# Altium project Arduino Uno.PrjPcb (part 2 of 3)
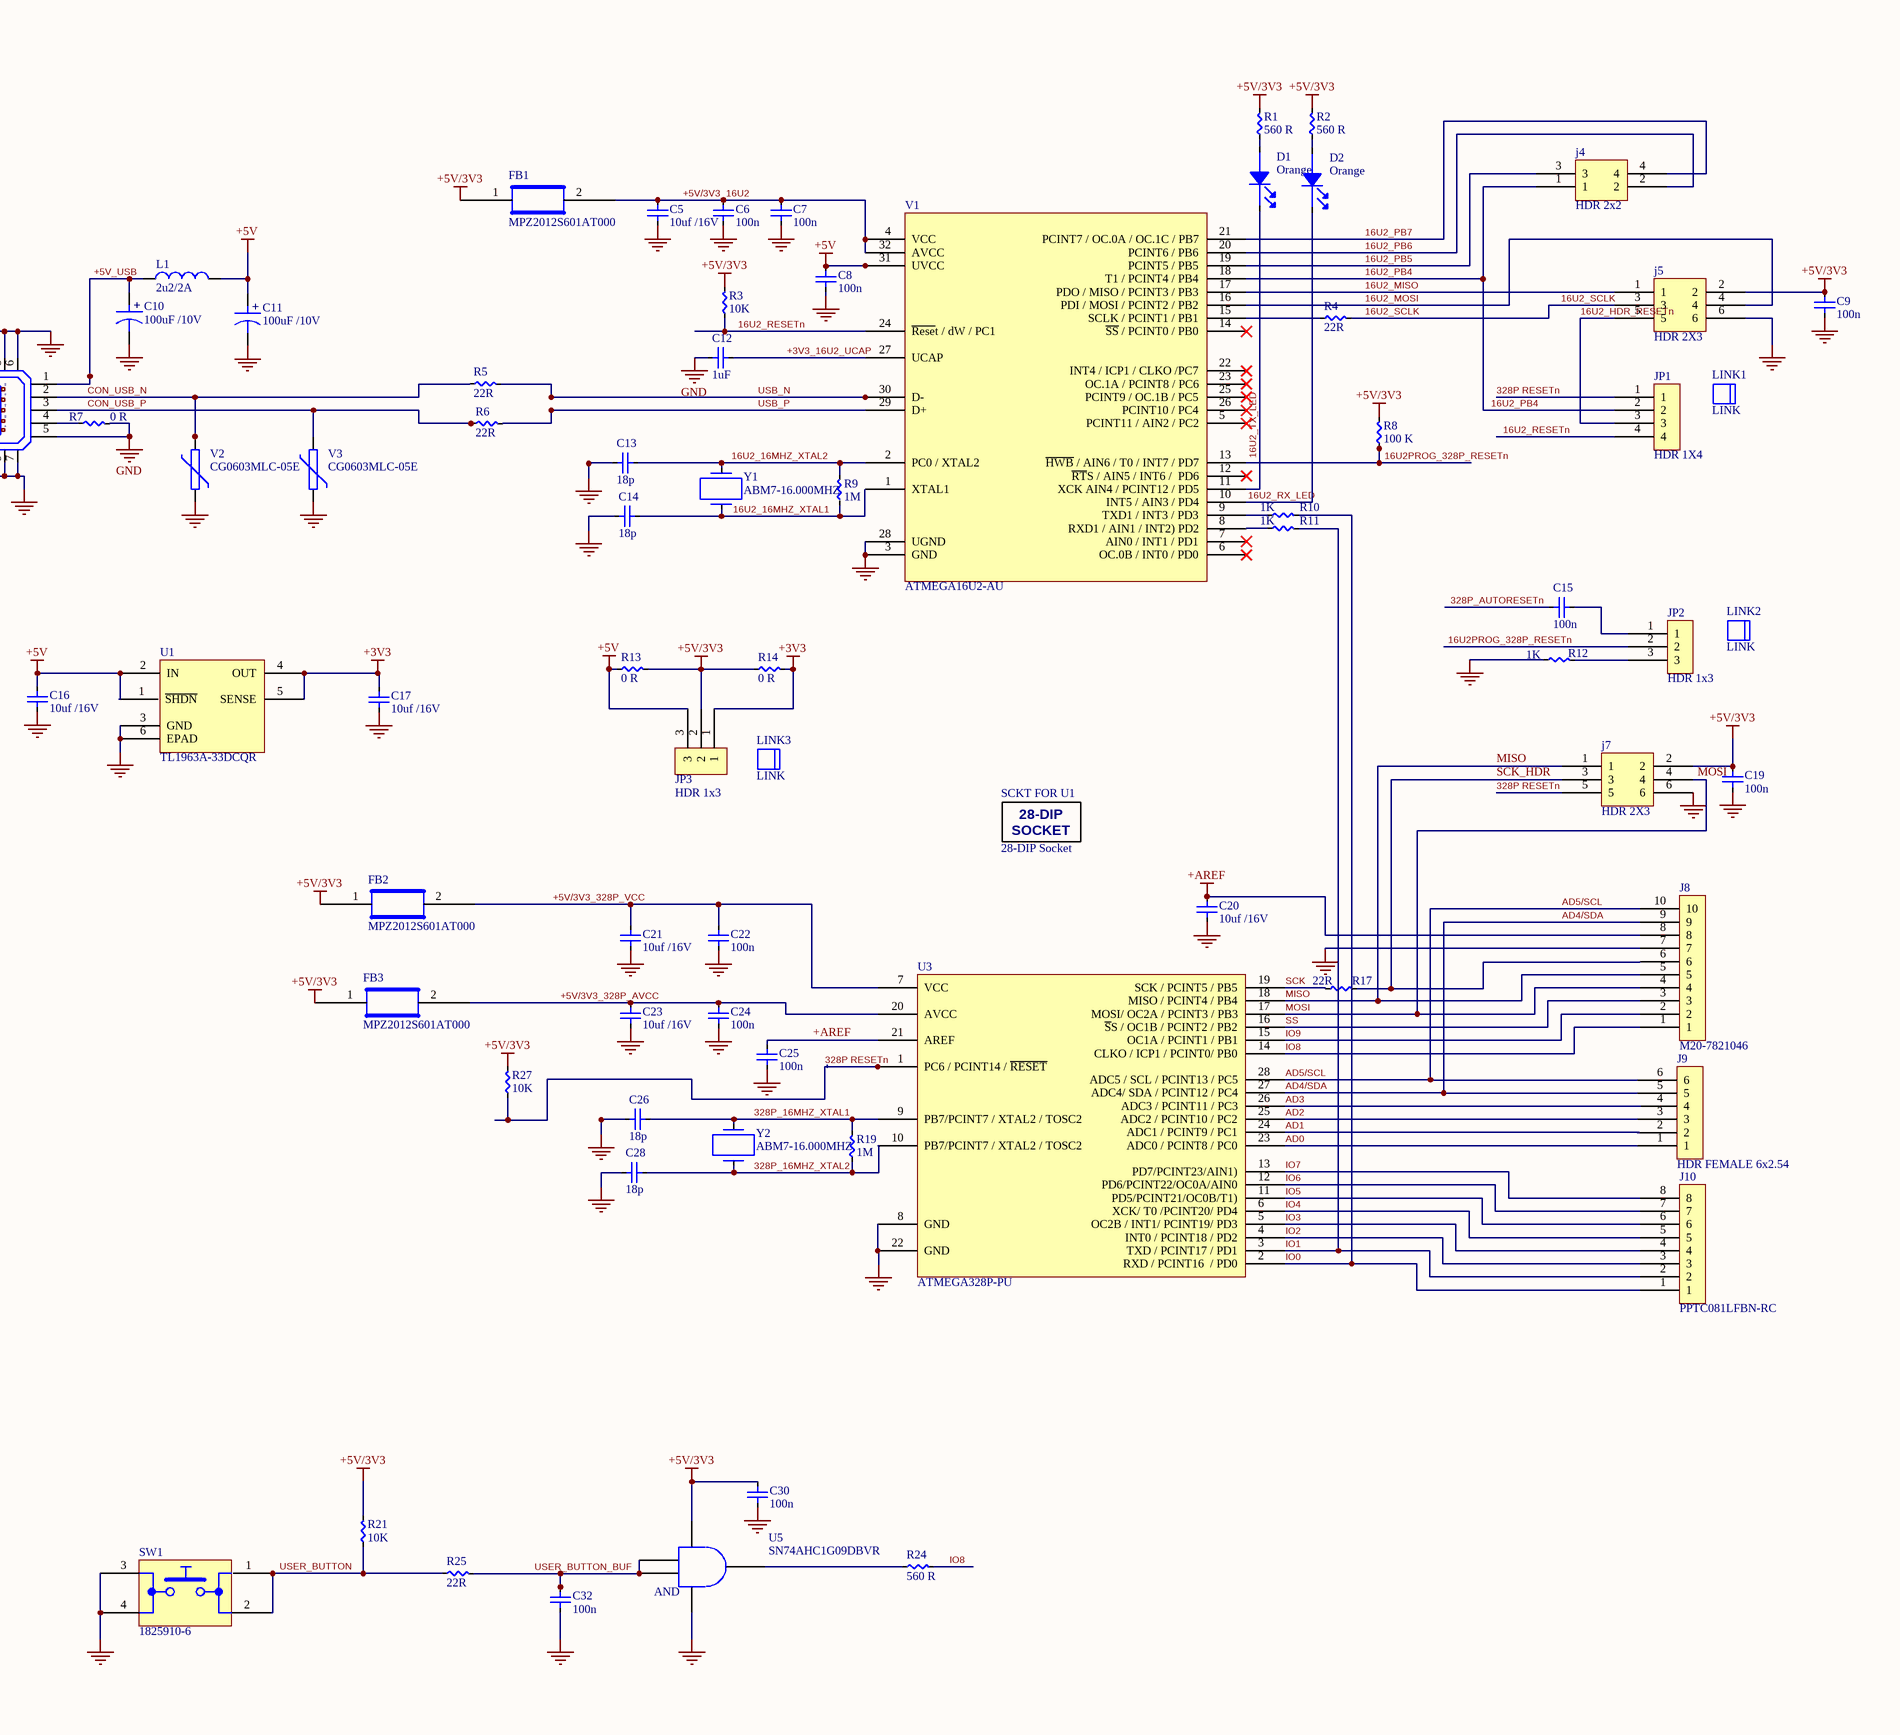
[diagram p2: Arduino_UNO_schematic.SchDoc, right]

## Sheet Arduino_UNO_schematic.SchDoc (continued)
### Library data of the parts
C1-C3 C6-C9 C15 C18 C19 C22 C24 C25 C27 C29-C33 = C0805C104M5RACAUTO: Cap Ceramic 0.1uF 50V X7R 20% SMD 0805 125°C Punched Paper T/R; Manufacturer: KEMET; Capacitance: 100nF; Mount: Surface Mount; Case/Package: 0805; Case Code (Metric): 2012; Case Code (Imperial): 0805; Contact Plating: Tin,Matte; Dielectric Material: Ceramic; Min Operating Temperature: -55°C; Max Operating Temperature: 125°C; Tolerance: 20%; Packaging: Cut Tape; Dielectric: X7R; Voltage Rating: 50V; Voltage Rating (DC): 50V; Termination: Wraparound; Length: 2mm; Width: 0.049inch; Thickness: 0.035inch; Depth: 1.25mm; Ratings: AEC-Q200; REACH SVHC: No SVHC; ComponentLink1URL: http://components.arrow.com/part/dataview/0323_00324909?src-supplier=Arrow+Europe; ComponentLink1Description: http://components.arrow.com/part/dataview/0323_00324909?src-supplier=Arrow+Europe; ComponentLink2URL: http://www.farnell.com/datasheets/2741360.pdf?src-supplier=Farnell; ComponentLink2Description: http://www.farnell.com/datasheets/2741360.pdf?src-supplier=Farnell; ComponentLink3URL: http://components.arrow.com/part/dataview/42933023S8615449N7429?src-supplier=Arrow; ComponentLink3Description: http://components.arrow.com/part/dataview/42933023S8615449N7429?src-supplier=Arrow; ComponentLink4URL: http://capacitoredge.kemet.com/capedge2/DataSheet/Datasheet-C0805C104M5RACAUTO.pdf?pn=C0805C104M5RACAUTO&src-supplier=Avnet+Asia; ComponentLink4Description: http://capacitoredge.kemet.com/capedge2/DataSheet/Datasheet-C0805C104M5RACAUTO.pdf?pn=C0805C104M5RACAUTO&src-supplier=Avnet+Asia; ComponentLink5URL: http://www.farnell.com/datasheets/2741360.pdf?src-supplier=Newark; ComponentLink5Description: http://www.farnell.com/datasheets/2741360.pdf?src-supplier=Newark; ComponentLink6URL: https://api.kemet.com/component-edge/download/datasheet/C0805C104M5RACAUTO.pdf?src-supplier=Digi-Key; ComponentLink6Description: https://api.kemet.com/component-edge/download/datasheet/C0805C104M5RACAUTO.pdf?src-supplier=Digi-Key; ComponentLink7URL: http://www.farnell.com/datasheets/2741360.pdf?src-supplier=Element14; ComponentLink7Description: http://www.farnell.com/datasheets/2741360.pdf?src-supplier=Element14; Manufacturer Part Number: C0805C104M5RACAUTO; Pricing 1: 1 = 0.15000, 10 = 0.11000, 50 = 0.06240, 100 = 0.05170, 500 = 0.03628, 1000 = 0.03004 (USD); RoHS: Yes; Stock 1: 12974; Supplier 1: Digi-Key; Supplier Part Number 1: 399-12977-6-ND
C4 C5 C16 C17 C20 C21 C23 = CGA4J1X7S1C106K125AC: TDK - CGA4J1X7S1C106K125AC - CGA4J1X7S1C106KT000N; Tolerance: 10%; Voltage Rating: 16V; Dielectric: X7S; Mount: Surface Mount; Case/Package: 0805; Weight: 0.000194oz; Case Code (Metric): 2012; Case Code (Imperial): 0805; Min Operating Temperature: -55°C; Max Operating Temperature: 125°C; Package Quantity: 2000; Packaging: Tape and Reel; Capacitance: 10uF; Termination: SMD/SMT; Voltage Rating (DC): 16V; Length: 0.079inch; Height: 1.25mm; Thickness: 0.057inch; Width: 0.049inch; Ratings: AEC-Q200; Lead Free: Lead Free; ComponentLink1URL: http://www.farnell.com/datasheets/2370668.pdf?src-supplier=Farnell; ComponentLink1Description: http://www.farnell.com/datasheets/2370668.pdf?src-supplier=Farnell; ComponentLink2URL: https://product.tdk.com/info/en/catalog/spec/mlccspec_automotive_general_midvoltage_en.pdf?src-supplier=Digi-Key; ComponentLink2Description: https://product.tdk.com/info/en/catalog/spec/mlccspec_automotive_general_midvoltage_en.pdf?src-supplier=Digi-Key; ComponentLink3URL: http://www.farnell.com/datasheets/2370668.pdf?src-supplier=Element14; ComponentLink3Description: http://www.farnell.com/datasheets/2370668.pdf?src-supplier=Element14; ComponentLink4URL: http://product.tdk.com/en/catalog/datasheets/mlcc_automotive_general_en.pdf?src-supplier=Avnet; ComponentLink4Description: http://product.tdk.com/en/catalog/datasheets/mlcc_automotive_general_en.pdf?src-supplier=Avnet; ComponentLink5URL: http://www.farnell.com/datasheets/2370668.pdf?src-supplier=Newark; ComponentLink5Description: http://www.farnell.com/datasheets/2370668.pdf?src-supplier=Newark; ComponentLink6URL: http://product.tdk.com/capacitor/mlcc/detailed_information.php?lang=en&ref=jp&part_no=CGA4J1X7S1C106K125AC&src-supplier=Mouser; ComponentLink6Description: http://product.tdk.com/capacitor/mlcc/detailed_information.php?lang=en&ref=jp&part_no=CGA4J1X7S1C106K125AC&src-supplier=Mouser; Manufacturer Part Number: CGA4J1X7S1C106K125AC; Manufacturer: TDK; Pricing 1: 1 = 0.43000, 10 = 0.30100, 50 = 0.22780, 100 = 0.19850, 500 = 0.14700, 1000 = 0.12495 (USD); RoHS: Yes; Stock 1: 230671; Supplier 1: Digi-Key; Supplier Part Number 1: 445-16110-1-ND
C10 C11 = EEE-1AA101SP: GLOVE, POLYAMIDE, L/FREE, PU, SIZE 6 - More Details; Manufacturer: Panasonic; Tolerance: 20%; Ripple Current: 70mA; Voltage Rating: 10V; Polarity: Polar; Life (Hours): 2000Hour; Leakage Current: 3uA; Mount: Surface Mount,PCB; Case/Package: Radial; Contact Plating: Tin; Min Operating Temperature: -40°C; Max Operating Temperature: 85°C; Capacitance: 100uF; Packaging: Tape and Reel; Package Quantity: 1000; Voltage Rating (DC): 10V; Termination: SMD/SMT; Ripple Current (AC): 70mA; Features: General Purpose; Voltage: 10V; Diameter: 6.3mm; Length: 5.5mm; Height: 5.4mm; Height - Seated (Max): 0.213inch; Radiation Hardening: No; Lead Free: Lead Free; REACH SVHC: Unknown; ComponentLink1URL: https://datasheet.ciiva.com/14604/70255710-14604862.pdf?src-supplier=Allied+Electronics; ComponentLink1Description: https://datasheet.ciiva.com/14604/70255710-14604862.pdf?src-supplier=Allied+Electronics; ComponentLink2URL: https://datasheet.ciiva.com/2983/aba0000ce2-2983905.pdf?src-supplier=Avnet; ComponentLink2Description: https://datasheet.ciiva.com/2983/aba0000ce2-2983905.pdf?src-supplier=Avnet; ComponentLink3URL: https://datasheet.ciiva.com/31414/aba0000ce2-31414629.pdf?src-supplier=Farnell; ComponentLink3Description: https://datasheet.ciiva.com/31414/aba0000ce2-31414629.pdf?src-supplier=Farnell; ComponentLink4URL: https://datasheet.ciiva.com/17536/aba0000ce2-17536070.pdf?src-supplier=Avnet+Europe; ComponentLink4Description: https://datasheet.ciiva.com/17536/aba0000ce2-17536070.pdf?src-supplier=Avnet+Europe; ComponentLink5URL: https://datasheet.ciiva.com/30099/11aba0000ce2-30099766.pdf?src-supplier=Onlinecomponents.com; ComponentLink5Description: https://datasheet.ciiva.com/30099/11aba0000ce2-30099766.pdf?src-supplier=Onlinecomponents.com; ComponentLink6URL: https://datasheet.ciiva.com/43470/aba0000ce2-43470621.pdf?src-supplier=Farnell; ComponentLink6Description: https://datasheet.ciiva.com/43470/aba0000ce2-43470621.pdf?src-supplier=Farnell; ComponentLink7URL: https://datasheet.ciiva.com/2985/aba0000ce2-2985040.pdf?src-supplier=Avnet; ComponentLink7Description: https://datasheet.ciiva.com/2985/aba0000ce2-2985040.pdf?src-supplier=Avnet; ComponentLink8URL: https://datasheet.ciiva.com/15166/getdatasheetpartid-178534-15166250.pdf?src-supplier=Verical; ComponentLink8Description: https://datasheet.ciiva.com/15166/getdatasheetpartid-178534-15166250.pdf?src-supplier=Verical; ComponentLink9URL: https://datasheet.ciiva.com/46378/aba0000ce2-46378266.pdf?src-supplier=Element14; ComponentLink9Description: https://datasheet.ciiva.com/46378/aba0000ce2-46378266.pdf?src-supplier=Element14; ComponentLink10URL: https://datasheet.ciiva.com/14598/70255710-14598444.pdf?src-supplier=Allied+Electronics; ComponentLink10Description: https://datasheet.ciiva.com/14598/70255710-14598444.pdf?src-supplier=Allied+Electronics; ComponentLink11URL: https://datasheet.ciiva.com/46374/aba0000ce2-46374349.pdf?src-supplier=Element14; ComponentLink11Description: https://datasheet.ciiva.com/46374/aba0000ce2-46374349.pdf?src-supplier=Element14; Manufacturer Part Number: EEE-1AA101SP; RoHS: Yes; Pricing 1: 1 = 0.30000, 10 = 0.20900, 50 = 0.14640, 100 = 0.12540, 500 = 0.09406 (USD); Stock 1: 1; Supplier 1: Digi-Key; Supplier Part Number 1: PCE3866CT-ND
C12 = C2012X5R1E105K125AA: TDK - C2012X5R1E105K125AA - SMD Multilayer Ceramic Capacitor, 1 µF, 25 V, 0805 [2012 Metric], ± 10%, X5R, C Series; Voltage Rating: 25V; Mount: Surface Mount; Case/Package: 0805; Number of Pins: 2; Weight: 0.000194oz; Case Code (Metric): 2012; Case Code (Imperial): 0805; Dielectric Material: Ceramic; Min Operating Temperature: -55°C; Max Operating Temperature: 85°C; Capacitance: 1uF; Packaging: Tape and Reel; Voltage Rating (DC): 25V; Termination: SMD/SMT; Dielectric: X5R; Tolerance: 10%; Package Quantity: 2000; Resistor Type: Ceramic; Voltage: 25V; Length: 2mm; Height: 1.25mm; Depth: 1.25mm; Width: 0.049inch; Thickness: 0.057inch; Radiation Hardening: No; Lead Free: Lead Free; REACH SVHC: No SVHC; ComponentLink1URL: https://datasheet.ciiva.com/11787/0900766b80c1bb00-11787608.pdf?src-supplier=RSComponents; ComponentLink1Description: https://datasheet.ciiva.com/11787/0900766b80c1bb00-11787608.pdf?src-supplier=RSComponents; ComponentLink2URL: https://datasheet.ciiva.com/16449/e412-c-16449595.pdf?src-supplier=Future+Electronics; ComponentLink2Description: https://datasheet.ciiva.com/16449/e412-c-16449595.pdf?src-supplier=Future+Electronics; ComponentLink3URL: https://datasheet.ciiva.com/28602/1744655-28602171.pdf?src-supplier=Element14; ComponentLink3Description: https://datasheet.ciiva.com/28602/1744655-28602171.pdf?src-supplier=Element14; ComponentLink4URL: https://datasheet.ciiva.com/15192/getdatasheetpartid-726707-15192140.pdf?src-supplier=Verical; ComponentLink4Description: https://datasheet.ciiva.com/15192/getdatasheetpartid-726707-15192140.pdf?src-supplier=Verical; Manufacturer: TDK; Manufacturer Part Number: C2012X5R1E105K125AA; Pricing 1: 1 = 0.23000, 10 = 0.15800, 50 = 0.09500, 100 = 0.08030, 500 = 0.05492, 1000 = 0.04858 (USD); RoHS: Yes; Stock 1: 16168; Supplier 1: Digi-Key; Supplier Part Number 1: 445-1419-1-ND
C13 C14 C26 C28 = C0805C180J5GACTU: CAP CER 18PF 50V C0G/NP0 0805; Manufacturer: KEMET; Dielectric Material: Ceramic; Tolerance: 5%; Dielectric: C0G; Temperature Coefficient: 30ppm/°C; Mount: Surface Mount; Case/Package: 0805; Contact Plating: Tin,Matte; Min Operating Temperature: -55°C; Max Operating Temperature: 125°C; Capacitance: 18pF; Packaging: Tape and Reel; Voltage: 50V; Termination: SMD/SMT; Voltage Rating (DC): 50V; Length: 2mm; Height: 0.78mm; Depth: 1.25mm; Radiation Hardening: No; Lead Free: Lead Free; ComponentLink1URL: https://datasheet.ciiva.com/22746/1769375-22746770.pdf?src-supplier=Element14; ComponentLink1Description: https://datasheet.ciiva.com/22746/1769375-22746770.pdf?src-supplier=Element14; ComponentLink2URL: https://datasheet.ciiva.com/26923/getdatasheetpartid-759702-26923980.pdf?src-supplier=Verical; ComponentLink2Description: https://datasheet.ciiva.com/26923/getdatasheetpartid-759702-26923980.pdf?src-supplier=Verical; ComponentLink3URL: https://datasheet.ciiva.com/26847/getdatasheetpartid-385668-26847862.pdf?src-supplier=Verical; ComponentLink3Description: https://datasheet.ciiva.com/26847/getdatasheetpartid-385668-26847862.pdf?src-supplier=Verical; Manufacturer Part Number: C0805C180J5GACTU; Pricing 1: 1 = 0.12000, 10 = 0.08600, 50 = 0.04900, 100 = 0.04070, 500 = 0.02852, 1000 = 0.02361 (USD); RoHS: Yes; Stock 1: 105501; Supplier 1: Digi-Key; Supplier Part Number 1: 399-1112-1-ND
D1 D2 D4 = LOL29K-H2K1-24-Z: OSRAM - LO L29K-H2K1-24-Z - SMARTLED 0603 ORANGE; Manufacturer: Osram Opto; Lens Color: White; Forward Current: 20mA; Forward Voltage: 2.2V; Luminous Intensity: 9mcd; Viewing Angle: 160°; Test Current: 2mA; Lens Style: Flat,Diffused,Colorless,Rectangular; Dominant Wavelength: 606nm; Luminous Flux: 0.025lm; Number of Elements: 1; Reverse Voltage: 12V; Lens Transparency: Diffused; Lens Size: 0.8mm; Mount: Surface Mount; Case/Package: 0603; Number of Pins: 2; Color: Orange; Case Code (Metric): 1608; Case Code (Imperial): 0603; Min Operating Temperature: -40°C; Max Operating Temperature: 100°C; Packaging: Tape and Reel; Number of LEDs: 1; Illumination Color: Orange; Package Quantity: 5000; Length: 1.3mm; Height: 0.65mm; Depth: 0.8mm; Width: 0.8mm; Radiation Hardening: No; ComponentLink1URL: https://datasheet.ciiva.com/2112/00077105-0-2112904.pdf?src-supplier=Digi-Key; ComponentLink1Description: https://datasheet.ciiva.com/2112/00077105-0-2112904.pdf?src-supplier=Digi-Key; ComponentLink2URL: https://datasheet.ciiva.com/2112/00077105-0-2112905.pdf?src-supplier=Digi-Key; ComponentLink2Description: https://datasheet.ciiva.com/2112/00077105-0-2112905.pdf?src-supplier=Digi-Key; ComponentLink3URL: https://datasheet.ciiva.com/2112/00077105-0-2112906.pdf?src-supplier=Digi-Key; ComponentLink3Description: https://datasheet.ciiva.com/2112/00077105-0-2112906.pdf?src-supplier=Digi-Key; ComponentLink4URL: https://datasheet.ciiva.com/15198/getdatasheetpartid-693885-15198412.pdf?src-supplier=Verical; ComponentLink4Description: https://datasheet.ciiva.com/15198/getdatasheetpartid-693885-15198412.pdf?src-supplier=Verical; Manufacturer Part Number: LOL29K-H2K1-24-Z; Pricing 1: 1 = 0.480000, 10 = 0.342000, 100 = 0.199600, 500 = 0.136900, 1000 = 0.114080, 2500 = 0.102670 (USD); RoHS: Yes; Stock 1: 8772; Supplier 1: Digi-Key; Supplier Part Number 1: 475-2740-1-ND
D3 = LGL29K-G2J1-24-Z: LED Uni-Color Green 572nm 2-Pin Chip 0603(1608Metric) T/R; Manufacturer: Osram Opto; Lens Color: White; Forward Current: 20mA; Forward Voltage: 2.2V; Luminous Intensity: 5.6mcd; Viewing Angle: 160°; Number of LEDs: 1; Lens Style: Flat,Diffused,Colorless,Rectangular; Lens Transparency: Diffused; Reverse Voltage: 12V; Test Current: 2mA; Dominant Wavelength: 570nm; Luminous Flux: 0.012lm; Lens Size: 0.8mm; Mount: Surface Mount; Case/Package: 0603; Number of Pins: 2; Case Code (Imperial): 0603; Case Code (Metric): 1608; Color: Green; Min Operating Temperature: -40°C; Max Operating Temperature: 100°C; Illumination Color: Green; Packaging: Tape and Reel; Package Quantity: 5000; Number of Elements: 1; Length: 1.3mm; Height: 0.65mm; Width: 0.8mm; Depth: 0.8mm; Radiation Hardening: No; ComponentLink1URL: https://datasheet.ciiva.com/4689/g-l29k-39844-4689584.pdf?src-supplier=Mouser; ComponentLink1Description: https://datasheet.ciiva.com/4689/g-l29k-39844-4689584.pdf?src-supplier=Mouser; ComponentLink2URL: https://datasheet.ciiva.com/15198/getdatasheetpartid-571127-15198411.pdf?src-supplier=Verical; ComponentLink2Description: https://datasheet.ciiva.com/15198/getdatasheetpartid-571127-15198411.pdf?src-supplier=Verical; ComponentLink3URL: https://datasheet.ciiva.com/2112/00077107-0-2112886.pdf?src-supplier=Digi-Key; ComponentLink3Description: https://datasheet.ciiva.com/2112/00077107-0-2112886.pdf?src-supplier=Digi-Key; ComponentLink4URL: https://datasheet.ciiva.com/2112/00077107-0-2112887.pdf?src-supplier=Digi-Key; ComponentLink4Description: https://datasheet.ciiva.com/2112/00077107-0-2112887.pdf?src-supplier=Digi-Key; ComponentLink5URL: https://datasheet.ciiva.com/2112/00077107-0-2112888.pdf?src-supplier=Digi-Key; ComponentLink5Description: https://datasheet.ciiva.com/2112/00077107-0-2112888.pdf?src-supplier=Digi-Key; Manufacturer Part Number: LGL29K-G2J1-24-Z; Pricing 1: 1 = 0.50000, 10 = 0.35500, 100 = 0.20710, 500 = 0.14198, 1000 = 0.11832, 2500 = 0.10649 (USD); RoHS: Yes; Stock 1: 12833; Supplier 1: Digi-Key; Supplier Part Number 1: 475-2709-1-ND
D5 D6 = BAT54HT1G: Small Signal Schottky Diode, Single, 30 V, 200 mA, 800 mV, 600 mA, 150 C ;RoHS Compliant: Yes; Manufacturer: ON Semiconductor / Fairchild; Forward Voltage: 800mV; Forward Current: 200mA; Recovery Time: 5ns; Max Repetitive Reverse Voltage (Vrrm): 30V; Peak Non-Repetitive Surge Current: 600mA; Max Reverse Current: 2uA; Power Dissipation: 200mW; Polarity: Standard; Capacitance: 10pF; Mount: Surface Mount; Number of Pins: 2; Contact Plating: Tin,Matte; Min Operating Temperature: -55°C; Max Operating Temperature: 150°C; Packaging: Tape and Reel; Package Quantity: 3000; Average Rectified Current: 200mA; Reverse Recovery Time: 5ns; Max Forward Surge Current (Ifsm): 600mA; Element Configuration: Single; Max Reverse Voltage (DC): 30V; Max Surge Current: 600mA; Voltage Rating (DC): 30V; Current Rating: 200mA; Output Current: 200mA; Reverse Voltage: 30V; Max Reverse Leakage Current: 2uA; Length: 1.8mm; Height: 1mm; Width: 1.35mm; Radiation Hardening: No; Lead Free: Lead Free; REACH SVHC: No SVHC; ComponentLink1URL: https://datasheet.ciiva.com/4714/bat54ht1-d-72881-4714706.pdf?src-supplier=Mouser; ComponentLink1Description: https://datasheet.ciiva.com/4714/bat54ht1-d-72881-4714706.pdf?src-supplier=Mouser; ComponentLink2URL: https://datasheet.ciiva.com/30479/0900766b811a63a9-30479442.pdf?src-supplier=RSComponents; ComponentLink2Description: https://datasheet.ciiva.com/30479/0900766b811a63a9-30479442.pdf?src-supplier=RSComponents; ComponentLink3URL: https://datasheet.ciiva.com/34301/806549-34301562.pdf?src-supplier=Jameco; ComponentLink3Description: https://datasheet.ciiva.com/34301/806549-34301562.pdf?src-supplier=Jameco; ComponentLink4URL: https://datasheet.ciiva.com/1240/1747983-1240762.pdf?src-supplier=Newark; ComponentLink4Description: https://datasheet.ciiva.com/1240/1747983-1240762.pdf?src-supplier=Newark; ComponentLink5URL: https://datasheet.ciiva.com/4452/bat54ht1g-104602-4452889.pdf?src-supplier=Mouser; ComponentLink5Description: https://datasheet.ciiva.com/4452/bat54ht1g-104602-4452889.pdf?src-supplier=Mouser; ComponentLink6URL: https://datasheet.ciiva.com/910/bat54ht1g-910497.pdf?src-supplier=Digi-Key; ComponentLink6Description: https://datasheet.ciiva.com/910/bat54ht1g-910497.pdf?src-supplier=Digi-Key; ComponentLink7URL: https://datasheet.ciiva.com/1180/bat54ht1-d-1180252.pdf?src-supplier=Element14; ComponentLink7Description: https://datasheet.ciiva.com/1180/bat54ht1-d-1180252.pdf?src-supplier=Element14; ComponentLink8URL: https://datasheet.ciiva.com/1180/bat54ht1-d-1180251.pdf?src-supplier=Element14; ComponentLink8Description: https://datasheet.ciiva.com/1180/bat54ht1-d-1180251.pdf?src-supplier=Element14; ComponentLink9URL: https://datasheet.ciiva.com/46429/1727620-46429206.pdf?src-supplier=Element14; ComponentLink9Description: https://datasheet.ciiva.com/46429/1727620-46429206.pdf?src-supplier=Element14; ComponentLink10URL: https://datasheet.ciiva.com/8294/bat54ht1-d-8294645.pdf?src-supplier=Avnet; ComponentLink10Description: https://datasheet.ciiva.com/8294/bat54ht1-d-8294645.pdf?src-supplier=Avnet; ComponentLink11URL: https://datasheet.ciiva.com/915/bat54ht1-d-915445.pdf?src-supplier=Digi-Key; ComponentLink11Description: https://datasheet.ciiva.com/915/bat54ht1-d-915445.pdf?src-supplier=Digi-Key; ComponentLink12URL: https://datasheet.ciiva.com/915/bat54ht1-d-915444.pdf?src-supplier=Digi-Key; ComponentLink12Description: https://datasheet.ciiva.com/915/bat54ht1-d-915444.pdf?src-supplier=Digi-Key; ComponentLink13URL: https://datasheet.ciiva.com/915/bat54ht1-d-915443.pdf?src-supplier=Digi-Key; ComponentLink13Description: https://datasheet.ciiva.com/915/bat54ht1-d-915443.pdf?src-supplier=Digi-Key; ComponentLink14URL: https://datasheet.ciiva.com/910/bat54ht1g-910499.pdf?src-supplier=Digi-Key; ComponentLink14Description: https://datasheet.ciiva.com/910/bat54ht1g-910499.pdf?src-supplier=Digi-Key; ComponentLink15URL: https://datasheet.ciiva.com/910/bat54ht1g-910498.pdf?src-supplier=Digi-Key; ComponentLink15Description: https://datasheet.ciiva.com/910/bat54ht1g-910498.pdf?src-supplier=Digi-Key; ComponentLink16URL: https://datasheet.ciiva.com/8303/bat54ht1g-8303645.pdf?src-supplier=Avnet; ComponentLink16Description: https://datasheet.ciiva.com/8303/bat54ht1g-8303645.pdf?src-supplier=Avnet; ComponentLink17URL: https://datasheet.ciiva.com/17020/bat54ht1g-17020445.pdf?src-supplier=Future+Electronics; ComponentLink17Description: https://datasheet.ciiva.com/17020/bat54ht1g-17020445.pdf?src-supplier=Future+Electronics; ComponentLink18URL: https://datasheet.ciiva.com/48686/001262925-da-01-en-diode-schottky-30v-bat54ht1g-sod-323-fsc-48686266.pdf?src-supplier=Conrad; ComponentLink18Description: https://datasheet.ciiva.com/48686/001262925-da-01-en-diode-schottky-30v-bat54ht1g-sod-323-fsc-48686266.pdf?src-supplier=Conrad; Manufacturer Part Number: BAT54HT1G; Pricing 1: 1 = 0.20000, 10 = 0.17300, 100 = 0.08140, 500 = 0.04830, 1000 = 0.03243 (USD); RoHS: Yes; Stock 1: 293925; Supplier 1: Digi-Key; Supplier Part Number 1: BAT54HT1GOSCT-ND
FB1-FB3 = MPZ2012S601AT000: FERRITE BEAD 600 OHM 0805 1LN; Manufacturer: TDK; Impedance: 600R; Current Rating: 2A; DC Resistance (DCR): 100mR; Mount: Surface Mount; Case/Package: 0805; Case Code (Metric): 2012; Case Code (Imperial): 0805; Packaging: Tape and Reel; Package Quantity: 1; Max DC Current: 2A; Length: 0.079inch; Height: 0.041inch; Width: 0.049inch; REACH SVHC: No SVHC; Lead Free: Lead Free; ComponentLink1URL: https://datasheet.ciiva.com/46634/beads-commercial-power-mpz-en-46634377.pdf?src-supplier=Digi-Key; ComponentLink1Description: https://datasheet.ciiva.com/46634/beads-commercial-power-mpz-en-46634377.pdf?src-supplier=Digi-Key; ComponentLink2URL: https://datasheet.ciiva.com/46634/beads-commercial-power-mpz-en-46634606.pdf?src-supplier=Digi-Key; ComponentLink2Description: https://datasheet.ciiva.com/46634/beads-commercial-power-mpz-en-46634606.pdf?src-supplier=Digi-Key; ComponentLink3URL: https://datasheet.ciiva.com/46634/beads-commercial-power-mpz-en-46634335.pdf?src-supplier=Digi-Key; ComponentLink3Description: https://datasheet.ciiva.com/46634/beads-commercial-power-mpz-en-46634335.pdf?src-supplier=Digi-Key; Manufacturer Part Number: MPZ2012S601AT000; Pricing 1: 1 = 0.11000, 10 = 0.09200, 25 = 0.08240, 50 = 0.06040, 100 = 0.05220, 250 = 0.04116, 500 = 0.03478, 1000 = 0.02928 (USD); RoHS: Yes; Stock 1: 200378; Supplier 1: Digi-Key; Supplier Part Number 1: 445-2206-1-ND
FID1-FID4 = FID_1MM
J1 J2 = PAD_WITH_HOLE_4MMx1.5MM
J3 J10 = PPTC081LFBN-RC: CONN HDR 8POS 0.1 TIN PCB; Manufacturer: Sullins; Number of Positions: 8; Connector Type: Header,Socket; Pitch: 0.1inch; Mount: Through Hole; Housing Material: Plastic; Contact Plating: Tin; Color: Black; Contact Material: Bronze; Package Quantity: 1000; Number of Rows: 1; Packaging: Bulk; Termination: Solder; Length: 20.8mm; Height: 8.5mm; Width: 2.5mm; Lead Free: Lead Free; ComponentLink1URL: https://media.digikey.com/pdf/Data%20Sheets/Sullins%20PDFs/Female_Headers.100_DS.pdf?src-supplier=Digi-Key; ComponentLink1Description: https://media.digikey.com/pdf/Data%20Sheets/Sullins%20PDFs/Female_Headers.100_DS.pdf?src-supplier=Digi-Key; ComponentLink2URL: http://www.sullinscorp.com/catalogs/78_Page80-81_HEADER_.100_2.54mm_FEMALE.pdf?src-supplier=Future+Electronics; ComponentLink2Description: http://www.sullinscorp.com/catalogs/78_Page80-81_HEADER_.100_2.54mm_FEMALE.pdf?src-supplier=Future+Electronics; Manufacturer Part Number: PPTC081LFBN-RC; Pricing 1: 1 = 0.65000, 10 = 0.60800, 100 = 0.46580, 500 = 0.40500, 1000 = 0.33413, 5000 = 0.29363, 10000 = 0.29250 (USD); RoHS: Yes; Stock 1: 46996; Supplier 1: Digi-Key; Supplier Part Number 1: S7006-ND
j4 = M20-9980245: 02+02 DIL Vert Pin Hdr; Manufacturer: Harwin; Number of Contacts: 4; Gender: Male; Max Current Rating: 3A; Contact Resistance: 25mR; Connector Type: Male Pin; Pitch: 2.54mm; Row Spacing: 0.1inch; Mount: Through Hole; Weight: 0.008395oz; Housing Color: Black; Contact Plating: Gold; Contact Material: Brass; Color: Black; Housing Material: Nylon; Min Operating Temperature: -40°C; Max Operating Temperature: 105°C; Termination: Solder; Number of Rows: 2; Number of Positions: 4; Orientation: Straight; Packaging: Bulk; Length: 5.08mm; Contact Mating Length: 0.24inch; Depth: 5.08mm; Radiation Hardening: No; ComponentLink1URL: https://datasheet.ciiva.com/26899/getdatasheetpartid-721707-26899431.pdf?src-supplier=Verical; ComponentLink1Description: https://datasheet.ciiva.com/26899/getdatasheetpartid-721707-26899431.pdf?src-supplier=Verical; ComponentLink2URL: https://datasheet.ciiva.com/6814/m20-998-6814779.pdf?src-supplier=Digi-Key; ComponentLink2Description: https://datasheet.ciiva.com/6814/m20-998-6814779.pdf?src-supplier=Digi-Key; Manufacturer Part Number: M20-9980245; Pricing 1: 1 = 0.24000, 10 = 0.22100, 100 = 0.15340, 500 = 0.12980, 1000 = 0.10620, 5000 = 0.09440, 10000 = 0.08555 (USD); RoHS: Yes; Stock 1: 7615; Supplier 1: Digi-Key; Supplier Part Number 1: 952-2119-ND
j5 j7 = M20-9760342: Headers & Wire Housings 03+03 DIL VERTICAL PIN HEADER GOLD+TIN; Manufacturer: Harwin; Current Rating: 3A; Voltage Rating: 750V; Contact Resistance: 25mR; Number of Positions: 6; Connector Type: Male Pin; Gender: Male; Pitch: 2.54mm; Row Spacing: 0.1inch; Mount: Through Hole; Housing Color: Black; Color: Black; Contact Plating: Gold; Contact Material: Brass; Housing Material: Nylon; Min Operating Temperature: -40°C; Max Operating Temperature: 105°C; Orientation: Straight; Package Quantity: 1000; Number of Rows: 2; Packaging: Bag; Max Current Rating: 3A; Termination: Solder; Number of Contacts: 6; Length: 7.62mm; Contact Mating Length: 0.228inch; Depth: 5.08mm; Radiation Hardening: No; ComponentLink1URL: https://datasheet.ciiva.com/26899/getdatasheetpartid-501523-26899404.pdf?src-supplier=Verical; ComponentLink1Description: https://datasheet.ciiva.com/26899/getdatasheetpartid-501523-26899404.pdf?src-supplier=Verical; ComponentLink2URL: https://datasheet.ciiva.com/9479/m20-976-9479738.pdf?src-supplier=Avnet; ComponentLink2Description: https://datasheet.ciiva.com/9479/m20-976-9479738.pdf?src-supplier=Avnet; ComponentLink3URL: https://datasheet.ciiva.com/16733/m20-976-16733096.pdf?src-supplier=Avnet+Europe; ComponentLink3Description: https://datasheet.ciiva.com/16733/m20-976-16733096.pdf?src-supplier=Avnet+Europe; Manufacturer Part Number: M20-9760342; Pricing 1: 1 = 0.28000, 10 = 0.25900, 100 = 0.17940, 500 = 0.15180, 1000 = 0.12420, 5000 = 0.11040, 10000 = 0.10005 (USD); RoHS: Yes; Stock 1: 7127; Supplier 1: Digi-Key; Supplier Part Number 1: 952-3275-ND
J6 = 10118193-0001LF: CONN USB MICRO B RECPT SMT R/A; Manufacturer: Amphenol FCI; Gender: Female; Connector Type: USB,Receptacle; Number of Contacts: 5; Number of Ports: 1; Current Rating: 1.8A; Insulation Resistance: 1GR; Max Voltage Rating (AC): 100V; Pitch: 0.65mm; Mount: Surface Mount,Horizontal; Contact Plating: Gold; Contact Material: Copper Alloy; Color: Black; Number of Terminals: 5; Housing Material: Polymer; Min Operating Temperature: -55°C; Max Operating Temperature: 85°C; Termination: Solder; Packaging: Tape and Reel; Orientation: Right Angle; Package Quantity: 1200; Voltage Rating: 100V; Features: Shielded; Length: 7.86mm; Depth: 5.67mm; Radiation Hardening: No; Flammability Rating: UL94 V-0; ComponentLink1URL: https://datasheet.ciiva.com/851/10118193-851106.pdf?src-supplier=Digi-Key; ComponentLink1Description: https://datasheet.ciiva.com/851/10118193-851106.pdf?src-supplier=Digi-Key; ComponentLink2URL: https://datasheet.ciiva.com/26853/getdatasheetpartid-418618-26853893.pdf?src-supplier=Verical; ComponentLink2Description: https://datasheet.ciiva.com/26853/getdatasheetpartid-418618-26853893.pdf?src-supplier=Verical; ComponentLink3URL: https://datasheet.ciiva.com/4598/10118193ac-197151-4598799.pdf?src-supplier=Mouser; ComponentLink3Description: https://datasheet.ciiva.com/4598/10118193ac-197151-4598799.pdf?src-supplier=Mouser; ComponentLink4URL: https://datasheet.ciiva.com/14802/10118193-0001lf-webpage-14802386.pdf?src-supplier=Arrow+Electronics; ComponentLink4Description: https://datasheet.ciiva.com/14802/10118193-0001lf-webpage-14802386.pdf?src-supplier=Arrow+Electronics; ComponentLink5URL: https://datasheet.ciiva.com/851/10118193-851107.pdf?src-supplier=Digi-Key; ComponentLink5Description: https://datasheet.ciiva.com/851/10118193-851107.pdf?src-supplier=Digi-Key; ComponentLink6URL: https://datasheet.ciiva.com/851/10118193-851108.pdf?src-supplier=Digi-Key; ComponentLink6Description: https://datasheet.ciiva.com/851/10118193-851108.pdf?src-supplier=Digi-Key; ComponentLink7URL: https://datasheet.ciiva.com/14618/70236827-14618887.pdf?src-supplier=Allied+Electronics; ComponentLink7Description: https://datasheet.ciiva.com/14618/70236827-14618887.pdf?src-supplier=Allied+Electronics; Pricing 1: 1 = 0.45000, 10 = 0.43000, 25 = 0.36840, 50 = 0.31320, 100 = 0.30090, 250 = 0.27016, 500 = 0.25788 (USD); Manufacturer Part Number: 10118193-0001LF; RoHS: Yes; Stock 1: 49172; Supplier 1: Digi-Key; Supplier Part Number 1: 609-4616-1-ND
J8 = HDR FEMALE 10x2.54: HARWIN - M20-7821046 - Board-To-Board Connector, M20 Series, Through Hole, Receptacle, 10, 2.54 mm, Tin Plated Contacts; Connector Type: Receptacle,Socket; Number of Positions: 10; Current Rating: 3A; Insulation Resistance: 1MR; Contact Resistance: 20mR; Mating Cycles: 50; Pitch: 2.54mm; Hole Diameter: 0.8mm; Mount: Through Hole; Case/Package: SIL; Color: Black; Contact Plating: Tin; Contact Material: Bronze; Housing Material: Polyamide; Housing Color: Black; Min Operating Temperature: -40°C; Max Operating Temperature: 105°C; Termination: Solder; Packaging: Rail/Tube; Number of Rows: 1; Package Quantity: 23; Number of Contacts: 10; Gender: Receptacle; Orientation: Straight; Max Current Rating: 3A; Contact Gender: Female; Length: 25.8mm; Depth: 2.5mm; Lead Pitch: 2.54mm; Radiation Hardening: No; REACH SVHC: No SVHC; ComponentLink1URL: https://datasheet.ciiva.com/26899/getdatasheetpartid-559226-26899379.pdf?src-supplier=Verical; ComponentLink1Description: https://datasheet.ciiva.com/26899/getdatasheetpartid-559226-26899379.pdf?src-supplier=Verical; ComponentLink2URL: https://datasheet.ciiva.com/11753/0900766b80dc1d2b-11753869.pdf?src-supplier=RSComponents; ComponentLink2Description: https://datasheet.ciiva.com/11753/0900766b80dc1d2b-11753869.pdf?src-supplier=RSComponents; ComponentLink3URL: https://datasheet.ciiva.com/6785/m20-782-6785605.pdf?src-supplier=Digi-Key; ComponentLink3Description: https://datasheet.ciiva.com/6785/m20-782-6785605.pdf?src-supplier=Digi-Key; ComponentLink4URL: https://datasheet.ciiva.com/10151/m20-782-10151366.pdf?src-supplier=Avnet; ComponentLink4Description: https://datasheet.ciiva.com/10151/m20-782-10151366.pdf?src-supplier=Avnet; ComponentLink5URL: https://datasheet.ciiva.com/16732/m20-782-16732152.pdf?src-supplier=Avnet+Europe; ComponentLink5Description: https://datasheet.ciiva.com/16732/m20-782-16732152.pdf?src-supplier=Avnet+Europe; Pricing 1: 1 = 1.28000, 10 = 1.12200, 100 = 0.96800, 500 = 0.79200, 1000 = 0.70400, 5000 = 0.61600, 10000 = 0.58520 (USD); RoHS: Yes; Stock 1: 142; Supplier 1: Digi-Key; Supplier Part Number 1: 952-1847-ND; Manufacturer: Harwin; Manufacturer Part Number: M20-7821046
J9 = HDR FEMALE 6x2.54: Female, 6 C, Straight, .100"CC; 3.20mm Tail, No Mt. 100u" Tin; PBT, Phos Bronze, 105 C; Manufacturer: Sullins; Manufacturer Part Number: PPTC061LFBN-RC; Connector Type: Header,Socket; Number of Positions: 6; Pitch: 0.1inch; Mount: Through Hole; Contact Material: Bronze; Housing Material: Plastic; Color: Black; Contact Plating: Tin; Package Quantity: 1000; Packaging: Bulk; Number of Rows: 1; Termination: Solder; Length: 15.7mm; Height: 8.5mm; Width: 2.5mm; Lead Free: Lead Free; ComponentLink1URL: https://media.digikey.com/pdf/Data%20Sheets/Sullins%20PDFs/Female_Headers.100_DS.pdf?src-supplier=Digi-Key; ComponentLink1Description: https://media.digikey.com/pdf/Data%20Sheets/Sullins%20PDFs/Female_Headers.100_DS.pdf?src-supplier=Digi-Key; ComponentLink2URL: http://www.sullinscorp.com/catalogs/78_Page80-81_HEADER_.100_2.54mm_FEMALE.pdf?src-supplier=Future+Electronics; ComponentLink2Description: http://www.sullinscorp.com/catalogs/78_Page80-81_HEADER_.100_2.54mm_FEMALE.pdf?src-supplier=Future+Electronics; Pricing 1: 1 = 0.52000, 10 = 0.48300, 100 = 0.37050, 500 = 0.32220, 1000 = 0.26582, 5000 = 0.23360, 10000 = 0.23270 (USD); RoHS: Yes; Stock 1: 40438; Supplier 1: Digi-Key; Supplier Part Number 1: S7004-ND
JP1 = M20-9990445: HARWIN - M20-9990445 - Board-To-Board Connector, 2.54 mm, 4 Contacts, Header, M20 Series, Through Hole, 1 Rows; Number of Contacts: 4; Gender: Male; Insulation Resistance: 10GR; Connector Type: Male Pin; Current Rating: 3A; Contact Resistance: 25mR; Pitch: 2.54mm; Mount: Through Hole; Case/Package: SIL; Weight: 0.1lb; Housing Material: Nylon; Housing Color: Black; Contact Material: Bronze,Brass; Contact Plating: Gold; Color: Black; Min Operating Temperature: -40°C; Max Operating Temperature: 105°C; Termination: Solder; Number of Rows: 1; Orientation: Straight; Number of Positions: 4; Max Current Rating: 3A; Packaging: Bulk; Package Quantity: 1000; Length: 10.16mm; Height: 0.1inch; Contact Mating Length: 0.24inch; Depth: 2.54mm; Width: 0.5inch; Radiation Hardening: No; REACH SVHC: No SVHC; ComponentLink1URL: https://datasheet.ciiva.com/11747/0900766b80da602d-11747748.pdf?src-supplier=RSComponents; ComponentLink1Description: https://datasheet.ciiva.com/11747/0900766b80da602d-11747748.pdf?src-supplier=RSComponents; ComponentLink2URL: https://datasheet.ciiva.com/16657/m20-999-16657086.pdf?src-supplier=Avnet+Europe; ComponentLink2Description: https://datasheet.ciiva.com/16657/m20-999-16657086.pdf?src-supplier=Avnet+Europe; ComponentLink3URL: https://datasheet.ciiva.com/26899/getdatasheetpartid-384172-26899445.pdf?src-supplier=Verical; ComponentLink3Description: https://datasheet.ciiva.com/26899/getdatasheetpartid-384172-26899445.pdf?src-supplier=Verical; ComponentLink4URL: https://datasheet.ciiva.com/8046/315376-8046934.pdf?src-supplier=Element14; ComponentLink4Description: https://datasheet.ciiva.com/8046/315376-8046934.pdf?src-supplier=Element14; ComponentLink5URL: https://datasheet.ciiva.com/5159/m20-999-351179-5159769.pdf?src-supplier=Mouser; ComponentLink5Description: https://datasheet.ciiva.com/5159/m20-999-351179-5159769.pdf?src-supplier=Mouser; ComponentLink6URL: https://datasheet.ciiva.com/6833/m20-999-6833324.pdf?src-supplier=Digi-Key; ComponentLink6Description: https://datasheet.ciiva.com/6833/m20-999-6833324.pdf?src-supplier=Digi-Key; ComponentLink7URL: https://datasheet.ciiva.com/9480/m20-999-9480237.pdf?src-supplier=Avnet; ComponentLink7Description: https://datasheet.ciiva.com/9480/m20-999-9480237.pdf?src-supplier=Avnet; Manufacturer: Harwin; Manufacturer Part Number: M20-9990445; Pricing 1: 1 = 0.19000, 10 = 0.18000, 100 = 0.12480, 500 = 0.10560, 1000 = 0.08640, 5000 = 0.07680, 10000 = 0.06960 (USD); RoHS: Yes; Stock 1: 22901; Supplier 1: Digi-Key; Supplier Part Number 1: 952-2265-ND
JP2 JP3 = M20-9990345: HARWIN - M20-9990345 - Board-To-Board Connector, Straight, 2.54 mm, 3 Contacts, Header, M20 Series, Through Hole, 1 Rows; Number of Contacts: 3; Connector Type: Male Pin; Current Rating: 3A; Contact Resistance: 25mR; Voltage Rating (AC): 750V; Insulation Resistance: 10GR; Pitch: 2.54mm; Mount: Through Hole; Case/Package: SIL; Weight: 0.006138oz; Housing Color: Black; Housing Material: Nylon; Contact Plating: Gold; Contact Material: Brass,Bronze; Color: Black; Min Operating Temperature: -40°C; Max Operating Temperature: 105°C; Number of Rows: 1; Termination: Solder; Package Quantity: 1000; Packaging: Bulk; Max Current Rating: 3A; Number of Positions: 3; Orientation: Straight; Length: 7.62mm; Height: 0.125inch; Width: 0.25inch; Contact Mating Length: 0.24inch; Depth: 2.54mm; Radiation Hardening: No; REACH SVHC: No SVHC; ComponentLink1URL: https://datasheet.ciiva.com/11747/0900766b80da602d-11747505.pdf?src-supplier=RSComponents; ComponentLink1Description: https://datasheet.ciiva.com/11747/0900766b80da602d-11747505.pdf?src-supplier=RSComponents; ComponentLink2URL: https://datasheet.ciiva.com/10151/m20-999-10151334.pdf?src-supplier=Avnet; ComponentLink2Description: https://datasheet.ciiva.com/10151/m20-999-10151334.pdf?src-supplier=Avnet; ComponentLink3URL: https://datasheet.ciiva.com/16657/m20-999-16657084.pdf?src-supplier=Avnet+Europe; ComponentLink3Description: https://datasheet.ciiva.com/16657/m20-999-16657084.pdf?src-supplier=Avnet+Europe; ComponentLink4URL: https://datasheet.ciiva.com/5160/m20-999-351179-5160492.pdf?src-supplier=Mouser; ComponentLink4Description: https://datasheet.ciiva.com/5160/m20-999-351179-5160492.pdf?src-supplier=Mouser; Manufacturer: Harwin; Manufacturer Part Number: M20-9990345; Pricing 1: 1 = 0.18000, 10 = 0.16500, 100 = 0.10150, 500 = 0.08400, 1000 = 0.07350, 5000 = 0.06300, 10000 = 0.06125 (USD); RoHS: Yes; Stock 1: 87210; Supplier 1: Digi-Key; Supplier Part Number 1: 952-2263-ND
L1 = L1210R2R2MDWIT: FIXED IND 2.2UH 2A 80 MOHM SMD; Manufacturer: KEMET; Core Material: Ferrite; Tolerance: 20%; Shielding: Unshielded; Self Resonant Frequency: 190MHz; DC Resistance (DCR): 80mR; Test Frequency: 100kHz; DC Current: 1.13A; Mount: Surface Mount; Case/Package: 1210; Case Code (Metric): 3225; Case Code (Imperial): 1210; Min Operating Temperature: -40°C; Max Operating Temperature: 105°C; Inductance: 2.2uH; Max DC Current: 2A; Package Quantity: 1000; Current Rating: 2A; Packaging: Tape and Reel; Inductance Tolerance: 20%; Resistor Type: Wirewound,Ceramic; Termination: SMD/SMT; Length: 0.126inch; Height: 2.5mm; Width: 0.098inch; Height - Seated (Max): 0.106inch; Depth: 2.7mm; Radiation Hardening: No; REACH SVHC: No SVHC; Military Standard: Not; ComponentLink1URL: https://datasheet.ciiva.com/4957/f3115-4957838.pdf?src-supplier=Mouser; ComponentLink1Description: https://datasheet.ciiva.com/4957/f3115-4957838.pdf?src-supplier=Mouser; ComponentLink2URL: https://datasheet.ciiva.com/6691/f3115-6691487.pdf?src-supplier=Digi-Key; ComponentLink2Description: https://datasheet.ciiva.com/6691/f3115-6691487.pdf?src-supplier=Digi-Key; ComponentLink3URL: https://datasheet.ciiva.com/8512/f3115-8512543.pdf?src-supplier=Avnet; ComponentLink3Description: https://datasheet.ciiva.com/8512/f3115-8512543.pdf?src-supplier=Avnet; ComponentLink4URL: https://datasheet.ciiva.com/17280/f3115-17280270.pdf?src-supplier=Avnet+Europe; ComponentLink4Description: https://datasheet.ciiva.com/17280/f3115-17280270.pdf?src-supplier=Avnet+Europe; ComponentLink5URL: https://datasheet.ciiva.com/22685/27262-22685038.pdf?src-supplier=Element14; ComponentLink5Description: https://datasheet.ciiva.com/22685/27262-22685038.pdf?src-supplier=Element14; Manufacturer Part Number: L1210R2R2MDWIT; Pricing 1: 1 = 0.48000, 10 = 0.41700, 25 = 0.38680, 50 = 0.32720, 100 = 0.29750, 250 = 0.27964, 500 = 0.24990 (USD); RoHS: Yes; Stock 1: 18080; Supplier 1: Digi-Key; Supplier Part Number 1: 399-9598-1-ND
LINK1-LINK3 = STC02SYAN: CONN JUMPER SHORTING TIN; Manufacturer: Sullins; Number of Positions: 2; Pitch: 0.1inch; Contact Plating: Tin; Color: Black; Package Quantity: 1000; Packaging: Bulk; Height: 0.256inch; Lead Free: Lead Free; ComponentLink1URL: https://datasheet.ciiva.com/16397/stc02syan-0-3252-16397402.pdf?src-supplier=Future+Electronics; ComponentLink1Description: https://datasheet.ciiva.com/16397/stc02syan-0-3252-16397402.pdf?src-supplier=Future+Electronics; ComponentLink2URL: https://datasheet.ciiva.com/767/134-c02syan-11134-767879.pdf?src-supplier=Digi-Key; ComponentLink2Description: https://datasheet.ciiva.com/767/134-c02syan-11134-767879.pdf?src-supplier=Digi-Key; Manufacturer Part Number: STC02SYAN; Pricing 1: 1 = 0.10000, 10 = 0.05900, 25 = 0.04400, 50 = 0.03780, 250 = 0.03152, 750 = 0.02835, 1000 = 0.02646, 12000 = 0.02016, 24000 = 0.01827 (USD); RoHS: Yes; Stock 1: 113539; Supplier 1: Digi-Key; Supplier Part Number 1: S9000-ND
R1 R2 R15 R16 R24 = RC0805FR-07560RL: Surface Mount Thick Film Resistor, RC Series, 560 ohm, 125 mW, - 1%, 150 V, 0805 [2012 Metric]; Manufacturer: Yageo; Resistance: 560R; Temperature Coefficient: 100ppm/°C; Power Rating: 125mW; Voltage Rating: 150V; Case/Package: 0805; Weight: 0.000194oz; Case Code (Metric): 2012; Case Code (Imperial): 0805; Min Operating Temperature: -55°C; Max Operating Temperature: 155°C; Tolerance: 1%; Resistor Type: Thick Film; Packaging: Tape and Reel; Package Quantity: 1; Number of Terminations: 2; Termination: SMD/SMT; Max Power Dissipation: 125mW; Features: Moisture Resistant; Length: 2mm; Height: 0.5mm; Width: 0.049inch; Depth: 1.25mm; REACH SVHC: Unknown; Lead Free: Lead Free; Military Standard: Not; ComponentLink1URL: https://datasheet.ciiva.com/2457/pyu-r-int-thick-7-2457140.pdf?src-supplier=Digi-Key; ComponentLink1Description: https://datasheet.ciiva.com/2457/pyu-r-int-thick-7-2457140.pdf?src-supplier=Digi-Key; ComponentLink2URL: https://datasheet.ciiva.com/2457/pyu-r-int-thick-7-2457141.pdf?src-supplier=Digi-Key; ComponentLink2Description: https://datasheet.ciiva.com/2457/pyu-r-int-thick-7-2457141.pdf?src-supplier=Digi-Key; ComponentLink3URL: https://datasheet.ciiva.com/5561/rc0805-5561861.pdf?src-supplier=Mouser; ComponentLink3Description: https://datasheet.ciiva.com/5561/rc0805-5561861.pdf?src-supplier=Mouser; ComponentLink4URL: https://datasheet.ciiva.com/7941/444164-7941813.pdf?src-supplier=Element14; ComponentLink4Description: https://datasheet.ciiva.com/7941/444164-7941813.pdf?src-supplier=Element14; ComponentLink5URL: https://datasheet.ciiva.com/2457/pyu-r-int-thick-7-2457142.pdf?src-supplier=Digi-Key; ComponentLink5Description: https://datasheet.ciiva.com/2457/pyu-r-int-thick-7-2457142.pdf?src-supplier=Digi-Key; ComponentLink6URL: https://datasheet.ciiva.com/7941/444164-7941814.pdf?src-supplier=Element14; ComponentLink6Description: https://datasheet.ciiva.com/7941/444164-7941814.pdf?src-supplier=Element14; Manufacturer Part Number: RC0805FR-07560RL; Pricing 1: 1 = 0.10000, 10 = 0.03600, 100 = 0.01480, 1000 = 0.00665, 2500 = 0.00577 (USD); RoHS: Yes; Stock 1: 30742; Supplier 1: Digi-Key; Supplier Part Number 1: 311-560CRCT-ND
R3 R18 R21-R23 R27 = RT0805FRE0710KL: Res Thin Film 0805 10K Ohm 1% 0.125W(1/8W) ±50ppm/C Epoxy Pad SMD T/R; Manufacturer: Yageo; Resistance: 10kR; Power Rating: 125mW; Voltage Rating: 150V; Temperature Coefficient: 50ppm/°C; Case/Package: 0805; Case Code (Imperial): 0805; Case Code (Metric): 2012; Min Operating Temperature: -55°C; Max Operating Temperature: 125°C; Tolerance: 1%; Packaging: Tape and Reel; Package Quantity: 5000; Resistor Type: Thin Film; Termination: SMD/SMT; Number of Terminations: 2; Max Power Dissipation: 125mW; Voltage Rating (DC): 150V; Working Voltage: 150V; Length: 2mm; Height: 0.024inch; Width: 1.25mm; Depth: 1.25mm; REACH SVHC: Unknown; Military Standard: Not; Lead Free: Lead Free; ComponentLink1URL: https://datasheet.ciiva.com/7942/1392914-7942071.pdf?src-supplier=Element14; ComponentLink1Description: https://datasheet.ciiva.com/7942/1392914-7942071.pdf?src-supplier=Element14; ComponentLink2URL: https://datasheet.ciiva.com/12834/pyu-rt-1-to-0-05-rohs-l-4-12834887.pdf?src-supplier=Mouser; ComponentLink2Description: https://datasheet.ciiva.com/12834/pyu-rt-1-to-0-05-rohs-l-4-12834887.pdf?src-supplier=Mouser; ComponentLink3URL: https://datasheet.ciiva.com/7942/1392914-7942072.pdf?src-supplier=Element14; ComponentLink3Description: https://datasheet.ciiva.com/7942/1392914-7942072.pdf?src-supplier=Element14; ComponentLink4URL: https://datasheet.ciiva.com/29711/pyu-rt-1-to-0-05-rohs-l-4-29711644.pdf?src-supplier=Digi-Key; ComponentLink4Description: https://datasheet.ciiva.com/29711/pyu-rt-1-to-0-05-rohs-l-4-29711644.pdf?src-supplier=Digi-Key; ComponentLink5URL: https://datasheet.ciiva.com/25647/pyu-rt-1-to-0-05-rohs-l-4-25647309.pdf?src-supplier=Digi-Key; ComponentLink5Description: https://datasheet.ciiva.com/25647/pyu-rt-1-to-0-05-rohs-l-4-25647309.pdf?src-supplier=Digi-Key; ComponentLink6URL: https://datasheet.ciiva.com/29711/pyu-rt-1-to-0-05-rohs-l-4-29711645.pdf?src-supplier=Digi-Key; ComponentLink6Description: https://datasheet.ciiva.com/29711/pyu-rt-1-to-0-05-rohs-l-4-29711645.pdf?src-supplier=Digi-Key; Manufacturer Part Number: RT0805FRE0710KL; Pricing 1: 1 = 0.10000, 10 = 0.08100, 100 = 0.03130, 1000 = 0.01375, 2500 = 0.01188 (USD); RoHS: Yes; Stock 1: 110599; Supplier 1: Digi-Key; Supplier Part Number 1: YAG1239CT-ND
R4-R6 R17 R20 R25 R26 = RC0805FR-0722RL: RES SMD 22 OHM 1% 1/8W 0805; Manufacturer: Yageo; Temperature Coefficient: 100ppm/°C; Max Power Dissipation: 125mW; Working Voltage: 150V; Case/Package: 0805; Case Code (Metric): 2012; Case Code (Imperial): 0805; Min Operating Temperature: -55°C; Max Operating Temperature: 155°C; Resistor Type: Thick Film; Resistance: 22R; Tolerance: 1%; Packaging: Tape and Reel; Features: Moisture Resistant; Number of Terminations: 2; Termination: SMD/SMT; Power Rating: 125mW; Voltage Rating: 150V; Package Quantity: 1; Length: 0.079inch; Height: 0.024inch; Width: 0.049inch; Depth: 1.25mm; REACH SVHC: Unknown; Lead Free: Lead Free; Military Standard: Not; ComponentLink1URL: https://datasheet.ciiva.com/11819/0900766b8106beab-11819837.pdf?src-supplier=RSComponents; ComponentLink1Description: https://datasheet.ciiva.com/11819/0900766b8106beab-11819837.pdf?src-supplier=RSComponents; ComponentLink2URL: https://datasheet.ciiva.com/2457/pyu-r-int-thick-7-2457044.pdf?src-supplier=Digi-Key; ComponentLink2Description: https://datasheet.ciiva.com/2457/pyu-r-int-thick-7-2457044.pdf?src-supplier=Digi-Key; ComponentLink3URL: https://datasheet.ciiva.com/46447/444164-46447574.pdf?src-supplier=Element14; ComponentLink3Description: https://datasheet.ciiva.com/46447/444164-46447574.pdf?src-supplier=Element14; ComponentLink4URL: https://datasheet.ciiva.com/2457/pyu-r-int-thick-7-2457045.pdf?src-supplier=Digi-Key; ComponentLink4Description: https://datasheet.ciiva.com/2457/pyu-r-int-thick-7-2457045.pdf?src-supplier=Digi-Key; ComponentLink5URL: https://datasheet.ciiva.com/2457/pyu-r-int-thick-7-2457046.pdf?src-supplier=Digi-Key; ComponentLink5Description: https://datasheet.ciiva.com/2457/pyu-r-int-thick-7-2457046.pdf?src-supplier=Digi-Key; ComponentLink6URL: https://datasheet.ciiva.com/12667/rc0805-12667371.pdf?src-supplier=Mouser; ComponentLink6Description: https://datasheet.ciiva.com/12667/rc0805-12667371.pdf?src-supplier=Mouser; Manufacturer Part Number: RC0805FR-0722RL; Pricing 1: 1 = 0.10000, 10 = 0.03600, 100 = 0.01480, 1000 = 0.00665, 2500 = 0.00577 (USD); RoHS: Yes; Stock 1: 681298; Supplier 1: Digi-Key; Supplier Part Number 1: 311-22.0CRCT-ND
R7 R13 R14 = RC0805JR-070RL: Surface Mount Thick Film Resistor, RC Series, 125 mW, - 5%, 150 V, 0805 [2012 Metric]; Manufacturer: Yageo; Resistance: 0mR; Power Rating: 125mW; Voltage Rating: 150V; Temperature Coefficient: 200ppm/°C; Case/Package: 0805; Number of Pins: 2; Contact Plating: Tin,Matte; Case Code (Imperial): 0805; Case Code (Metric): 2012; Min Operating Temperature: -55°C; Max Operating Temperature: 155°C; Resistor Type: Thick Film; Tolerance: 5%; Packaging: Tape and Reel; Voltage Rating (DC): 150V; Termination: SMD/SMT; Length: 2mm; Height: 0.5mm; Width: 1.25mm; Depth: 1.25mm; Radiation Hardening: No; REACH SVHC: Unknown; Military Standard: Not; Lead Free: Lead Free; ComponentLink1URL: https://datasheet.ciiva.com/7941/1738694-7941861.pdf?src-supplier=Element14; ComponentLink1Description: https://datasheet.ciiva.com/7941/1738694-7941861.pdf?src-supplier=Element14; ComponentLink2URL: https://datasheet.ciiva.com/11819/0900766b8106beab-11819430.pdf?src-supplier=RSComponents; ComponentLink2Description: https://datasheet.ciiva.com/11819/0900766b8106beab-11819430.pdf?src-supplier=RSComponents; ComponentLink3URL: https://datasheet.ciiva.com/7941/1738694-7941862.pdf?src-supplier=Element14; ComponentLink3Description: https://datasheet.ciiva.com/7941/1738694-7941862.pdf?src-supplier=Element14; ComponentLink4URL: https://datasheet.ciiva.com/7941/1738694-7941863.pdf?src-supplier=Element14; ComponentLink4Description: https://datasheet.ciiva.com/7941/1738694-7941863.pdf?src-supplier=Element14; ComponentLink5URL: https://datasheet.ciiva.com/15190/getdatasheetpartid-330685-15190028.pdf?src-supplier=Verical; ComponentLink5Description: https://datasheet.ciiva.com/15190/getdatasheetpartid-330685-15190028.pdf?src-supplier=Verical; Manufacturer Part Number: RC0805JR-070RL; RoHS: Yes; Stock 1: 5973411; Pricing 1: 1 = 0.10000, 10 = 0.03100, 25 = 0.02280, 50 = 0.01720, 100 = 0.01270, 250 = 0.00972, 500 = 0.00778, 1000 = 0.00572 (USD); Supplier 1: Digi-Key; Supplier Part Number 1: 311-0.0ARCT-ND